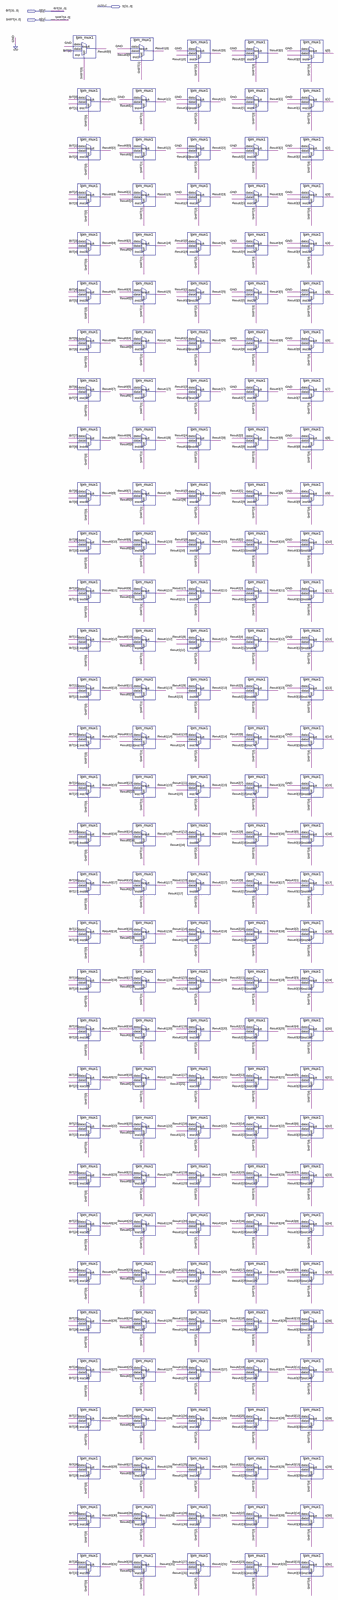
[diagram p0: schematic sheet, whole]
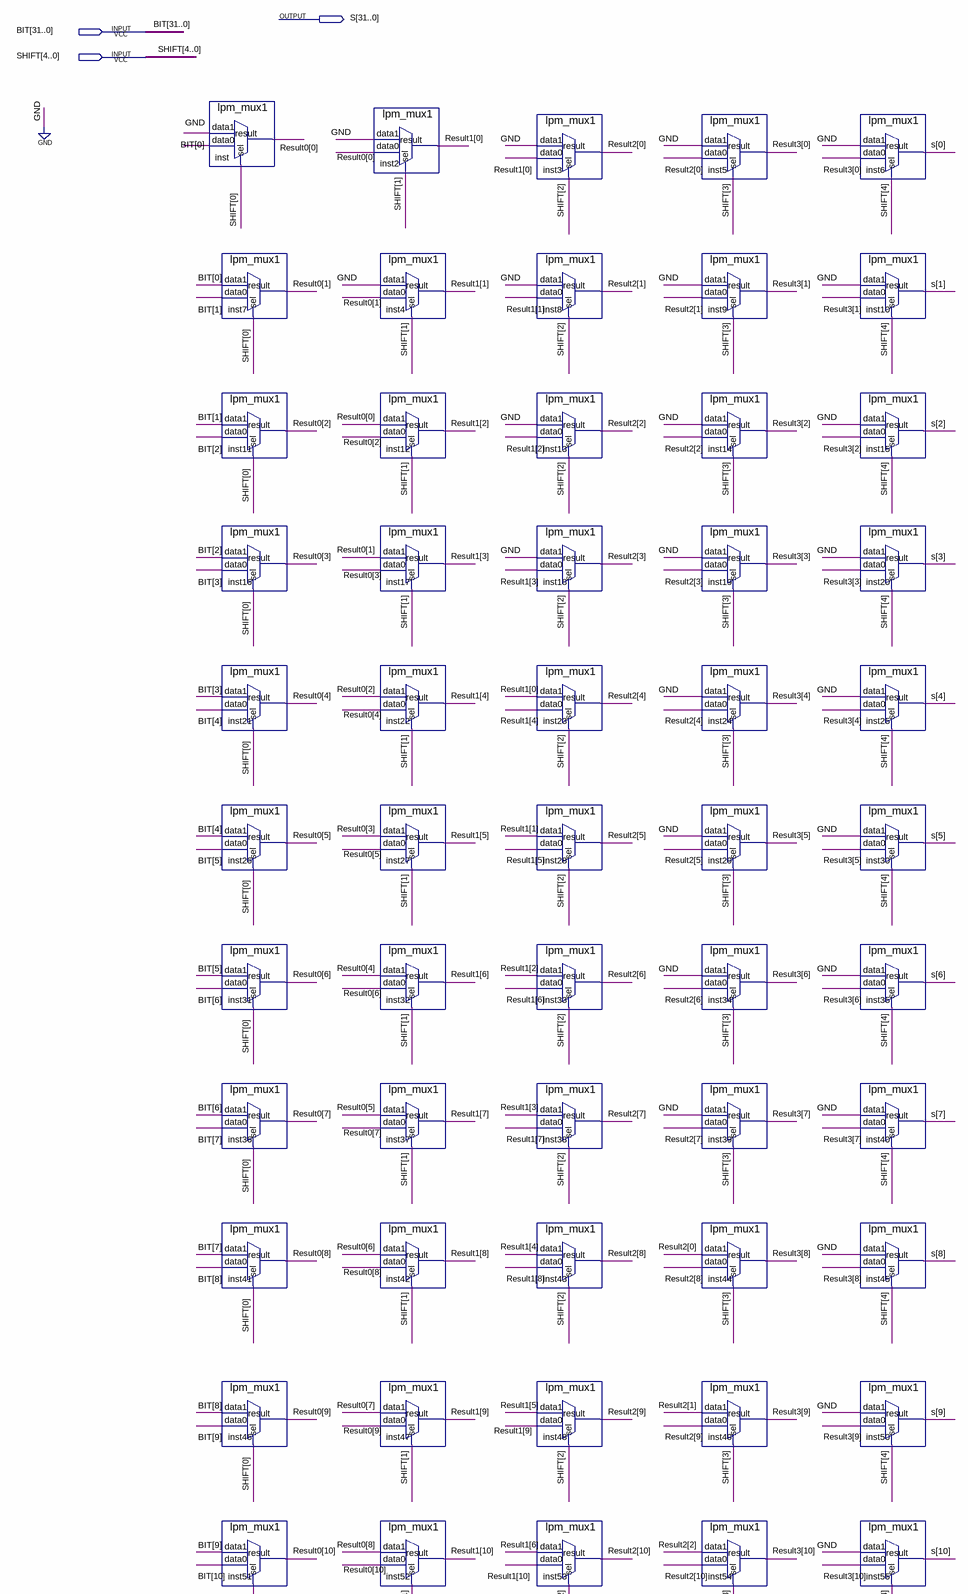
[diagram p1: schematic sheet, upper part]
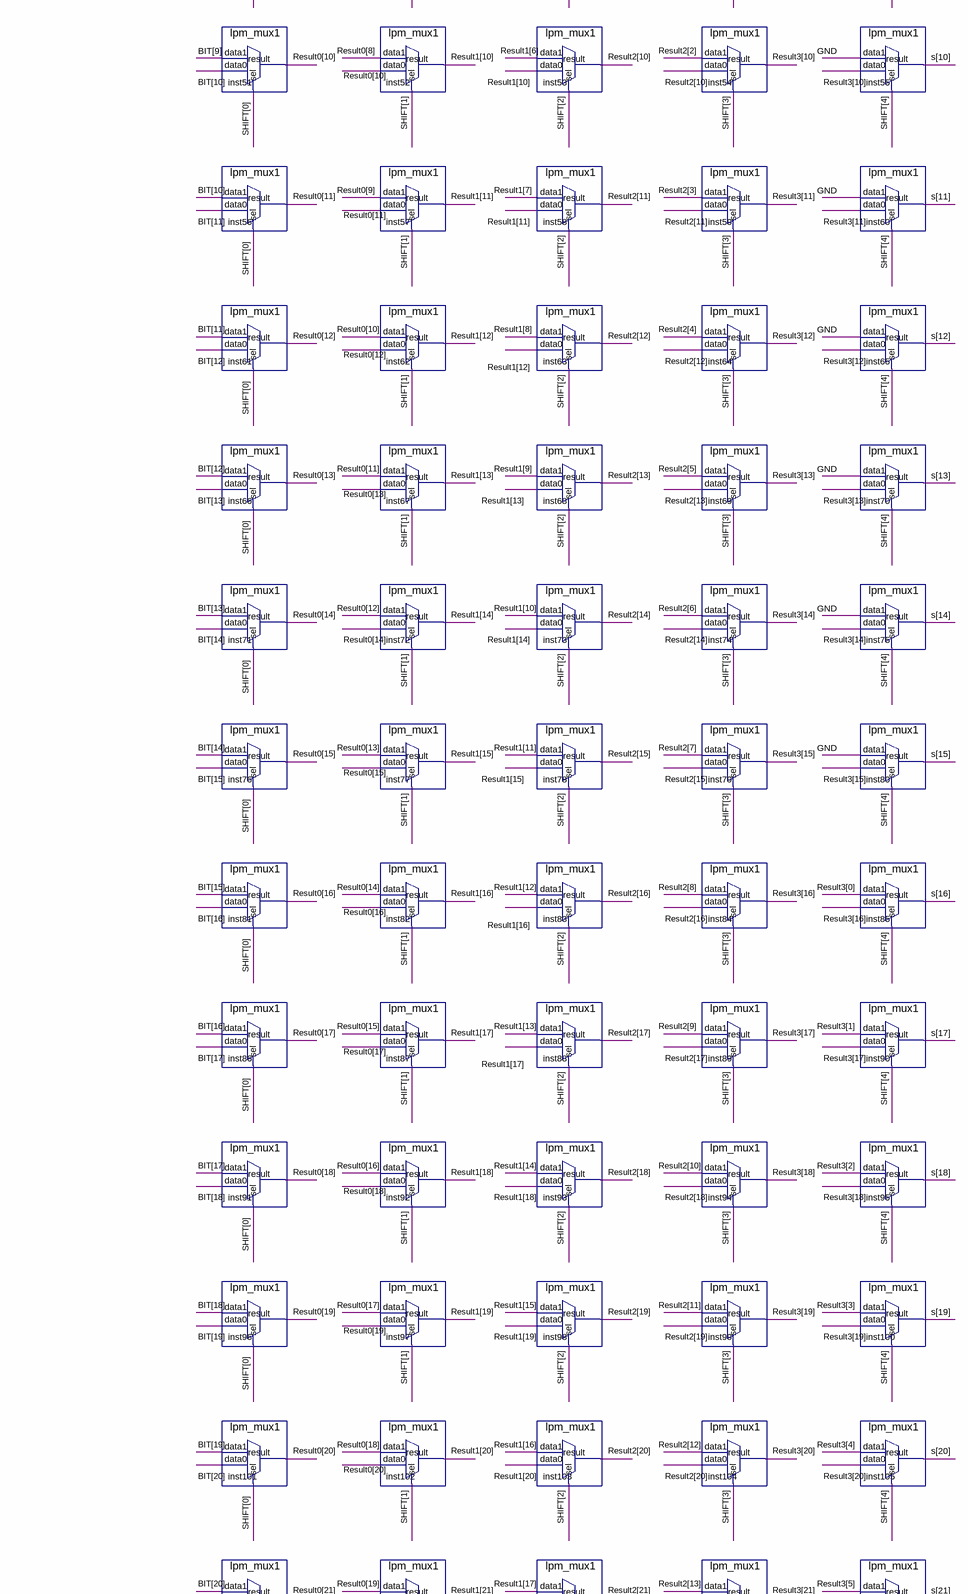
[diagram p2: schematic sheet, middle part]
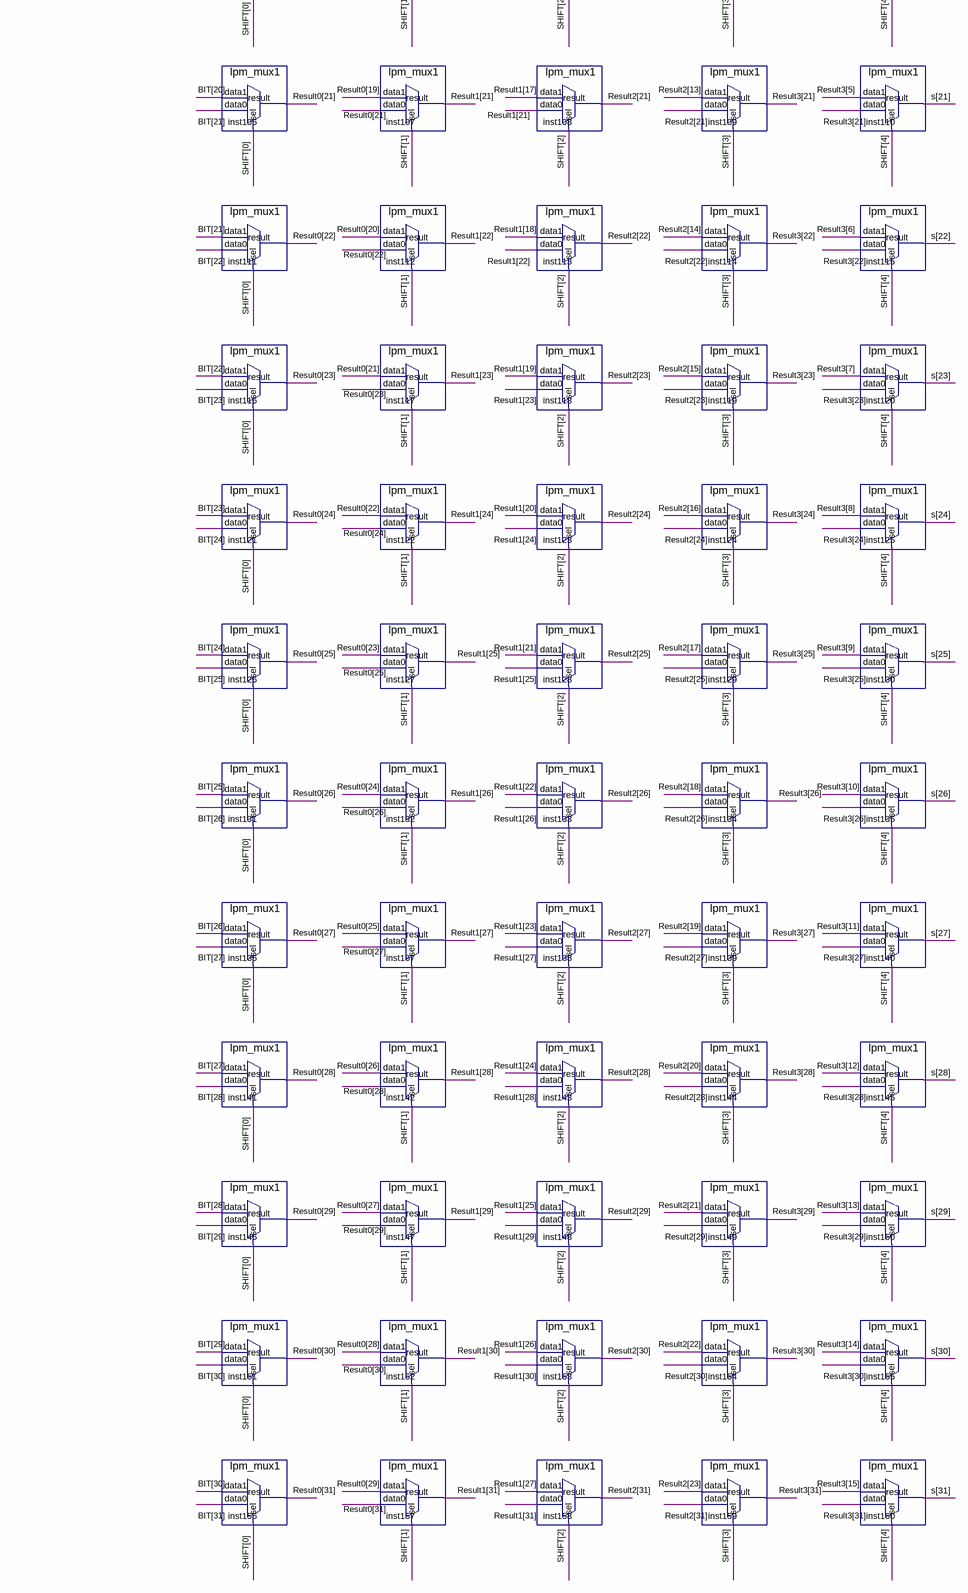
[diagram p3: schematic sheet, lower part]
// Quartus schematic Shift_Left_Logical.bdf as structural Verilog: 160 symbols, 3 pins
module Shift_Left_Logical (
  input  [31:0] BIT,
  input  [4:0] SHIFT,
  output [31:0] S
);

  wire [31:0] Result0, Result1, Result2, Result3;

  lpm_mux1 inst (.data1(1'b0), .data0(BIT[0]), .sel(SHIFT[0]), .result(Result0[0]));
  lpm_mux1 inst7 (.data1(BIT[0]), .data0(BIT[1]), .sel(SHIFT[0]), .result(Result0[1]));
  lpm_mux1 inst11 (.data1(BIT[1]), .data0(BIT[2]), .sel(SHIFT[0]), .result(Result0[2]));
  lpm_mux1 inst16 (.data1(BIT[2]), .data0(BIT[3]), .sel(SHIFT[0]), .result(Result0[3]));
  lpm_mux1 inst21 (.data1(BIT[3]), .data0(BIT[4]), .sel(SHIFT[0]), .result(Result0[4]));
  lpm_mux1 inst26 (.data1(BIT[4]), .data0(BIT[5]), .sel(SHIFT[0]), .result(Result0[5]));
  lpm_mux1 inst31 (.data1(BIT[5]), .data0(BIT[6]), .sel(SHIFT[0]), .result(Result0[6]));
  lpm_mux1 inst36 (.data1(BIT[6]), .data0(BIT[7]), .sel(SHIFT[0]), .result(Result0[7]));
  lpm_mux1 inst41 (.data1(BIT[7]), .data0(BIT[8]), .sel(SHIFT[0]), .result(Result0[8]));
  lpm_mux1 inst46 (.data1(BIT[8]), .data0(BIT[9]), .sel(SHIFT[0]), .result(Result0[9]));
  lpm_mux1 inst51 (.data1(BIT[9]), .data0(BIT[10]), .sel(SHIFT[0]), .result(Result0[10]));
  lpm_mux1 inst56 (.data1(BIT[10]), .data0(BIT[11]), .sel(SHIFT[0]), .result(Result0[11]));
  lpm_mux1 inst61 (.data1(BIT[11]), .data0(BIT[12]), .sel(SHIFT[0]), .result(Result0[12]));
  lpm_mux1 inst66 (.data1(BIT[12]), .data0(BIT[13]), .sel(SHIFT[0]), .result(Result0[13]));
  lpm_mux1 inst71 (.data1(BIT[13]), .data0(BIT[14]), .sel(SHIFT[0]), .result(Result0[14]));
  lpm_mux1 inst76 (.data1(BIT[14]), .data0(BIT[15]), .sel(SHIFT[0]), .result(Result0[15]));
  lpm_mux1 inst81 (.data1(BIT[15]), .data0(BIT[16]), .sel(SHIFT[0]), .result(Result0[16]));
  lpm_mux1 inst86 (.data1(BIT[16]), .data0(BIT[17]), .sel(SHIFT[0]), .result(Result0[17]));
  lpm_mux1 inst91 (.data1(BIT[17]), .data0(BIT[18]), .sel(SHIFT[0]), .result(Result0[18]));
  lpm_mux1 inst96 (.data1(BIT[18]), .data0(BIT[19]), .sel(SHIFT[0]), .result(Result0[19]));
  lpm_mux1 inst101 (.data1(BIT[19]), .data0(BIT[20]), .sel(SHIFT[0]), .result(Result0[20]));
  lpm_mux1 inst106 (.data1(BIT[20]), .data0(BIT[21]), .sel(SHIFT[0]), .result(Result0[21]));
  lpm_mux1 inst111 (.data1(BIT[21]), .data0(BIT[22]), .sel(SHIFT[0]), .result(Result0[22]));
  lpm_mux1 inst116 (.data1(BIT[22]), .data0(BIT[23]), .sel(SHIFT[0]), .result(Result0[23]));
  lpm_mux1 inst121 (.data1(BIT[23]), .data0(BIT[24]), .sel(SHIFT[0]), .result(Result0[24]));
  lpm_mux1 inst126 (.data1(BIT[24]), .data0(BIT[25]), .sel(SHIFT[0]), .result(Result0[25]));
  lpm_mux1 inst131 (.data1(BIT[25]), .data0(BIT[26]), .sel(SHIFT[0]), .result(Result0[26]));
  lpm_mux1 inst136 (.data1(BIT[26]), .data0(BIT[27]), .sel(SHIFT[0]), .result(Result0[27]));
  lpm_mux1 inst141 (.data1(BIT[27]), .data0(BIT[28]), .sel(SHIFT[0]), .result(Result0[28]));
  lpm_mux1 inst146 (.data1(BIT[28]), .data0(BIT[29]), .sel(SHIFT[0]), .result(Result0[29]));
  lpm_mux1 inst151 (.data1(BIT[29]), .data0(BIT[30]), .sel(SHIFT[0]), .result(Result0[30]));
  lpm_mux1 inst156 (.data1(BIT[30]), .data0(BIT[31]), .sel(SHIFT[0]), .result(Result0[31]));
  lpm_mux1 inst2 (.data1(1'b0), .data0(Result0[0]), .sel(SHIFT[1]), .result(Result1[0]));
  lpm_mux1 inst4 (.data1(1'b0), .data0(Result0[1]), .sel(SHIFT[1]), .result(Result1[1]));
  lpm_mux1 inst12 (.data1(Result0[0]), .data0(Result0[2]), .sel(SHIFT[1]), .result(Result1[2]));
  lpm_mux1 inst17 (.data1(Result0[1]), .data0(Result0[3]), .sel(SHIFT[1]), .result(Result1[3]));
  lpm_mux1 inst22 (.data1(Result0[2]), .data0(Result0[4]), .sel(SHIFT[1]), .result(Result1[4]));
  lpm_mux1 inst27 (.data1(Result0[3]), .data0(Result0[5]), .sel(SHIFT[1]), .result(Result1[5]));
  lpm_mux1 inst32 (.data1(Result0[4]), .data0(Result0[6]), .sel(SHIFT[1]), .result(Result1[6]));
  lpm_mux1 inst37 (.data1(Result0[5]), .data0(Result0[7]), .sel(SHIFT[1]), .result(Result1[7]));
  lpm_mux1 inst42 (.data1(Result0[6]), .data0(Result0[8]), .sel(SHIFT[1]), .result(Result1[8]));
  lpm_mux1 inst47 (.data1(Result0[7]), .data0(Result0[9]), .sel(SHIFT[1]), .result(Result1[9]));
  lpm_mux1 inst52 (.data1(Result0[8]), .data0(Result0[10]), .sel(SHIFT[1]), .result(Result1[10]));
  lpm_mux1 inst57 (.data1(Result0[9]), .data0(Result0[11]), .sel(SHIFT[1]), .result(Result1[11]));
  lpm_mux1 inst62 (.data1(Result0[10]), .data0(Result0[12]), .sel(SHIFT[1]), .result(Result1[12]));
  lpm_mux1 inst67 (.data1(Result0[11]), .data0(Result0[13]), .sel(SHIFT[1]), .result(Result1[13]));
  lpm_mux1 inst72 (.data1(Result0[12]), .data0(Result0[14]), .sel(SHIFT[1]), .result(Result1[14]));
  lpm_mux1 inst77 (.data1(Result0[13]), .data0(Result0[15]), .sel(SHIFT[1]), .result(Result1[15]));
  lpm_mux1 inst82 (.data1(Result0[14]), .data0(Result0[16]), .sel(SHIFT[1]), .result(Result1[16]));
  lpm_mux1 inst87 (.data1(Result0[15]), .data0(Result0[17]), .sel(SHIFT[1]), .result(Result1[17]));
  lpm_mux1 inst92 (.data1(Result0[16]), .data0(Result0[18]), .sel(SHIFT[1]), .result(Result1[18]));
  lpm_mux1 inst97 (.data1(Result0[17]), .data0(Result0[19]), .sel(SHIFT[1]), .result(Result1[19]));
  lpm_mux1 inst102 (.data1(Result0[18]), .data0(Result0[20]), .sel(SHIFT[1]), .result(Result1[20]));
  lpm_mux1 inst107 (.data1(Result0[19]), .data0(Result0[21]), .sel(SHIFT[1]), .result(Result1[21]));
  lpm_mux1 inst112 (.data1(Result0[20]), .data0(Result0[22]), .sel(SHIFT[1]), .result(Result1[22]));
  lpm_mux1 inst117 (.data1(Result0[21]), .data0(Result0[23]), .sel(SHIFT[1]), .result(Result1[23]));
  lpm_mux1 inst122 (.data1(Result0[22]), .data0(Result0[24]), .sel(SHIFT[1]), .result(Result1[24]));
  lpm_mux1 inst127 (.data1(Result0[23]), .data0(Result0[25]), .sel(SHIFT[1]), .result(Result1[25]));
  lpm_mux1 inst132 (.data1(Result0[24]), .data0(Result0[26]), .sel(SHIFT[1]), .result(Result1[26]));
  lpm_mux1 inst137 (.data1(Result0[25]), .data0(Result0[27]), .sel(SHIFT[1]), .result(Result1[27]));
  lpm_mux1 inst142 (.data1(Result0[26]), .data0(Result0[28]), .sel(SHIFT[1]), .result(Result1[28]));
  lpm_mux1 inst147 (.data1(Result0[27]), .data0(Result0[29]), .sel(SHIFT[1]), .result(Result1[29]));
  lpm_mux1 inst152 (.data1(Result0[28]), .data0(Result0[30]), .sel(SHIFT[1]), .result(Result1[30]));
  lpm_mux1 inst157 (.data1(Result0[29]), .data0(Result0[31]), .sel(SHIFT[1]), .result(Result1[31]));
  lpm_mux1 inst3 (.data1(1'b0), .data0(Result1[0]), .sel(SHIFT[2]), .result(Result2[0]));
  lpm_mux1 inst8 (.data1(1'b0), .data0(Result1[1]), .sel(SHIFT[2]), .result(Result2[1]));
  lpm_mux1 inst13 (.data1(1'b0), .data0(Result1[2]), .sel(SHIFT[2]), .result(Result2[2]));
  lpm_mux1 inst18 (.data1(1'b0), .data0(Result1[3]), .sel(SHIFT[2]), .result(Result2[3]));
  lpm_mux1 inst23 (.data1(Result1[0]), .data0(Result1[4]), .sel(SHIFT[2]), .result(Result2[4]));
  lpm_mux1 inst28 (.data1(Result1[1]), .data0(Result1[5]), .sel(SHIFT[2]), .result(Result2[5]));
  lpm_mux1 inst33 (.data1(Result1[2]), .data0(Result1[6]), .sel(SHIFT[2]), .result(Result2[6]));
  lpm_mux1 inst38 (.data1(Result1[3]), .data0(Result1[7]), .sel(SHIFT[2]), .result(Result2[7]));
  lpm_mux1 inst43 (.data1(Result1[4]), .data0(Result1[8]), .sel(SHIFT[2]), .result(Result2[8]));
  lpm_mux1 inst48 (.data1(Result1[5]), .data0(Result1[9]), .sel(SHIFT[2]), .result(Result2[9]));
  lpm_mux1 inst53 (.data1(Result1[6]), .data0(Result1[10]), .sel(SHIFT[2]), .result(Result2[10]));
  lpm_mux1 inst58 (.data1(Result1[7]), .data0(Result1[11]), .sel(SHIFT[2]), .result(Result2[11]));
  lpm_mux1 inst63 (.data1(Result1[8]), .data0(Result1[12]), .sel(SHIFT[2]), .result(Result2[12]));
  lpm_mux1 inst68 (.data1(Result1[9]), .data0(Result1[13]), .sel(SHIFT[2]), .result(Result2[13]));
  lpm_mux1 inst73 (.data1(Result1[10]), .data0(Result1[14]), .sel(SHIFT[2]), .result(Result2[14]));
  lpm_mux1 inst78 (.data1(Result1[11]), .data0(Result1[15]), .sel(SHIFT[2]), .result(Result2[15]));
  lpm_mux1 inst83 (.data1(Result1[12]), .data0(Result1[16]), .sel(SHIFT[2]), .result(Result2[16]));
  lpm_mux1 inst88 (.data1(Result1[13]), .data0(Result1[17]), .sel(SHIFT[2]), .result(Result2[17]));
  lpm_mux1 inst93 (.data1(Result1[14]), .data0(Result1[18]), .sel(SHIFT[2]), .result(Result2[18]));
  lpm_mux1 inst98 (.data1(Result1[15]), .data0(Result1[19]), .sel(SHIFT[2]), .result(Result2[19]));
  lpm_mux1 inst103 (.data1(Result1[16]), .data0(Result1[20]), .sel(SHIFT[2]), .result(Result2[20]));
  lpm_mux1 inst108 (.data1(Result1[17]), .data0(Result1[21]), .sel(SHIFT[2]), .result(Result2[21]));
  lpm_mux1 inst113 (.data1(Result1[18]), .data0(Result1[22]), .sel(SHIFT[2]), .result(Result2[22]));
  lpm_mux1 inst118 (.data1(Result1[19]), .data0(Result1[23]), .sel(SHIFT[2]), .result(Result2[23]));
  lpm_mux1 inst123 (.data1(Result1[20]), .data0(Result1[24]), .sel(SHIFT[2]), .result(Result2[24]));
  lpm_mux1 inst128 (.data1(Result1[21]), .data0(Result1[25]), .sel(SHIFT[2]), .result(Result2[25]));
  lpm_mux1 inst133 (.data1(Result1[22]), .data0(Result1[26]), .sel(SHIFT[2]), .result(Result2[26]));
  lpm_mux1 inst138 (.data1(Result1[23]), .data0(Result1[27]), .sel(SHIFT[2]), .result(Result2[27]));
  lpm_mux1 inst143 (.data1(Result1[24]), .data0(Result1[28]), .sel(SHIFT[2]), .result(Result2[28]));
  lpm_mux1 inst148 (.data1(Result1[25]), .data0(Result1[29]), .sel(SHIFT[2]), .result(Result2[29]));
  lpm_mux1 inst153 (.data1(Result1[26]), .data0(Result1[30]), .sel(SHIFT[2]), .result(Result2[30]));
  lpm_mux1 inst158 (.data1(Result1[27]), .data0(Result1[31]), .sel(SHIFT[2]), .result(Result2[31]));
  lpm_mux1 inst5 (.data1(1'b0), .data0(Result2[0]), .sel(SHIFT[3]), .result(Result3[0]));
  lpm_mux1 inst9 (.data1(1'b0), .data0(Result2[1]), .sel(SHIFT[3]), .result(Result3[1]));
  lpm_mux1 inst14 (.data1(1'b0), .data0(Result2[2]), .sel(SHIFT[3]), .result(Result3[2]));
  lpm_mux1 inst19 (.data1(1'b0), .data0(Result2[3]), .sel(SHIFT[3]), .result(Result3[3]));
  lpm_mux1 inst24 (.data1(1'b0), .data0(Result2[4]), .sel(SHIFT[3]), .result(Result3[4]));
  lpm_mux1 inst29 (.data1(1'b0), .data0(Result2[5]), .sel(SHIFT[3]), .result(Result3[5]));
  lpm_mux1 inst34 (.data1(1'b0), .data0(Result2[6]), .sel(SHIFT[3]), .result(Result3[6]));
  lpm_mux1 inst39 (.data1(1'b0), .data0(Result2[7]), .sel(SHIFT[3]), .result(Result3[7]));
  lpm_mux1 inst44 (.data1(Result2[0]), .data0(Result2[8]), .sel(SHIFT[3]), .result(Result3[8]));
  lpm_mux1 inst49 (.data1(Result2[1]), .data0(Result2[9]), .sel(SHIFT[3]), .result(Result3[9]));
  lpm_mux1 inst54 (.data1(Result2[2]), .data0(Result2[10]), .sel(SHIFT[3]), .result(Result3[10]));
  lpm_mux1 inst59 (.data1(Result2[3]), .data0(Result2[11]), .sel(SHIFT[3]), .result(Result3[11]));
  lpm_mux1 inst64 (.data1(Result2[4]), .data0(Result2[12]), .sel(SHIFT[3]), .result(Result3[12]));
  lpm_mux1 inst69 (.data1(Result2[5]), .data0(Result2[13]), .sel(SHIFT[3]), .result(Result3[13]));
  lpm_mux1 inst74 (.data1(Result2[6]), .data0(Result2[14]), .sel(SHIFT[3]), .result(Result3[14]));
  lpm_mux1 inst79 (.data1(Result2[7]), .data0(Result2[15]), .sel(SHIFT[3]), .result(Result3[15]));
  lpm_mux1 inst84 (.data1(Result2[8]), .data0(Result2[16]), .sel(SHIFT[3]), .result(Result3[16]));
  lpm_mux1 inst89 (.data1(Result2[9]), .data0(Result2[17]), .sel(SHIFT[3]), .result(Result3[17]));
  lpm_mux1 inst94 (.data1(Result2[10]), .data0(Result2[18]), .sel(SHIFT[3]), .result(Result3[18]));
  lpm_mux1 inst99 (.data1(Result2[11]), .data0(Result2[19]), .sel(SHIFT[3]), .result(Result3[19]));
  lpm_mux1 inst104 (.data1(Result2[12]), .data0(Result2[20]), .sel(SHIFT[3]), .result(Result3[20]));
  lpm_mux1 inst109 (.data1(Result2[13]), .data0(Result2[21]), .sel(SHIFT[3]), .result(Result3[21]));
  lpm_mux1 inst114 (.data1(Result2[14]), .data0(Result2[22]), .sel(SHIFT[3]), .result(Result3[22]));
  lpm_mux1 inst119 (.data1(Result2[15]), .data0(Result2[23]), .sel(SHIFT[3]), .result(Result3[23]));
  lpm_mux1 inst124 (.data1(Result2[16]), .data0(Result2[24]), .sel(SHIFT[3]), .result(Result3[24]));
  lpm_mux1 inst129 (.data1(Result2[17]), .data0(Result2[25]), .sel(SHIFT[3]), .result(Result3[25]));
  lpm_mux1 inst134 (.data1(Result2[18]), .data0(Result2[26]), .sel(SHIFT[3]), .result(Result3[26]));
  lpm_mux1 inst139 (.data1(Result2[19]), .data0(Result2[27]), .sel(SHIFT[3]), .result(Result3[27]));
  lpm_mux1 inst144 (.data1(Result2[20]), .data0(Result2[28]), .sel(SHIFT[3]), .result(Result3[28]));
  lpm_mux1 inst149 (.data1(Result2[21]), .data0(Result2[29]), .sel(SHIFT[3]), .result(Result3[29]));
  lpm_mux1 inst154 (.data1(Result2[22]), .data0(Result2[30]), .sel(SHIFT[3]), .result(Result3[30]));
  lpm_mux1 inst159 (.data1(Result2[23]), .data0(Result2[31]), .sel(SHIFT[3]), .result(Result3[31]));
  lpm_mux1 inst6 (.data1(1'b0), .data0(Result3[0]), .sel(SHIFT[4]), .result(S[0]));
  lpm_mux1 inst10 (.data1(1'b0), .data0(Result3[1]), .sel(SHIFT[4]), .result(S[1]));
  lpm_mux1 inst15 (.data1(1'b0), .data0(Result3[2]), .sel(SHIFT[4]), .result(S[2]));
  lpm_mux1 inst20 (.data1(1'b0), .data0(Result3[3]), .sel(SHIFT[4]), .result(S[3]));
  lpm_mux1 inst25 (.data1(1'b0), .data0(Result3[4]), .sel(SHIFT[4]), .result(S[4]));
  lpm_mux1 inst30 (.data1(1'b0), .data0(Result3[5]), .sel(SHIFT[4]), .result(S[5]));
  lpm_mux1 inst35 (.data1(1'b0), .data0(Result3[6]), .sel(SHIFT[4]), .result(S[6]));
  lpm_mux1 inst40 (.data1(1'b0), .data0(Result3[7]), .sel(SHIFT[4]), .result(S[7]));
  lpm_mux1 inst45 (.data1(1'b0), .data0(Result3[8]), .sel(SHIFT[4]), .result(S[8]));
  lpm_mux1 inst50 (.data1(1'b0), .data0(Result3[9]), .sel(SHIFT[4]), .result(S[9]));
  lpm_mux1 inst55 (.data1(1'b0), .data0(Result3[10]), .sel(SHIFT[4]), .result(S[10]));
  lpm_mux1 inst60 (.data1(1'b0), .data0(Result3[11]), .sel(SHIFT[4]), .result(S[11]));
  lpm_mux1 inst65 (.data1(1'b0), .data0(Result3[12]), .sel(SHIFT[4]), .result(S[12]));
  lpm_mux1 inst70 (.data1(1'b0), .data0(Result3[13]), .sel(SHIFT[4]), .result(S[13]));
  lpm_mux1 inst75 (.data1(1'b0), .data0(Result3[14]), .sel(SHIFT[4]), .result(S[14]));
  lpm_mux1 inst80 (.data1(1'b0), .data0(Result3[15]), .sel(SHIFT[4]), .result(S[15]));
  lpm_mux1 inst85 (.data1(Result3[0]), .data0(Result3[16]), .sel(SHIFT[4]), .result(S[16]));
  lpm_mux1 inst90 (.data1(Result3[1]), .data0(Result3[17]), .sel(SHIFT[4]), .result(S[17]));
  lpm_mux1 inst95 (.data1(Result3[2]), .data0(Result3[18]), .sel(SHIFT[4]), .result(S[18]));
  lpm_mux1 inst100 (.data1(Result3[3]), .data0(Result3[19]), .sel(SHIFT[4]), .result(S[19]));
  lpm_mux1 inst105 (.data1(Result3[4]), .data0(Result3[20]), .sel(SHIFT[4]), .result(S[20]));
  lpm_mux1 inst110 (.data1(Result3[5]), .data0(Result3[21]), .sel(SHIFT[4]), .result(S[21]));
  lpm_mux1 inst115 (.data1(Result3[6]), .data0(Result3[22]), .sel(SHIFT[4]), .result(S[22]));
  lpm_mux1 inst120 (.data1(Result3[7]), .data0(Result3[23]), .sel(SHIFT[4]), .result(S[23]));
  lpm_mux1 inst125 (.data1(Result3[8]), .data0(Result3[24]), .sel(SHIFT[4]), .result(S[24]));
  lpm_mux1 inst130 (.data1(Result3[9]), .data0(Result3[25]), .sel(SHIFT[4]), .result(S[25]));
  lpm_mux1 inst135 (.data1(Result3[10]), .data0(Result3[26]), .sel(SHIFT[4]), .result(S[26]));
  lpm_mux1 inst140 (.data1(Result3[11]), .data0(Result3[27]), .sel(SHIFT[4]), .result(S[27]));
  lpm_mux1 inst145 (.data1(Result3[12]), .data0(Result3[28]), .sel(SHIFT[4]), .result(S[28]));
  lpm_mux1 inst150 (.data1(Result3[13]), .data0(Result3[29]), .sel(SHIFT[4]), .result(S[29]));
  lpm_mux1 inst155 (.data1(Result3[14]), .data0(Result3[30]), .sel(SHIFT[4]), .result(S[30]));
  lpm_mux1 inst160 (.data1(Result3[15]), .data0(Result3[31]), .sel(SHIFT[4]), .result(S[31]));
endmodule
